# Altium schematic sheet Buck Converter.SchDoc
size A4; SheetNumber: 8; SheetTotal: 10
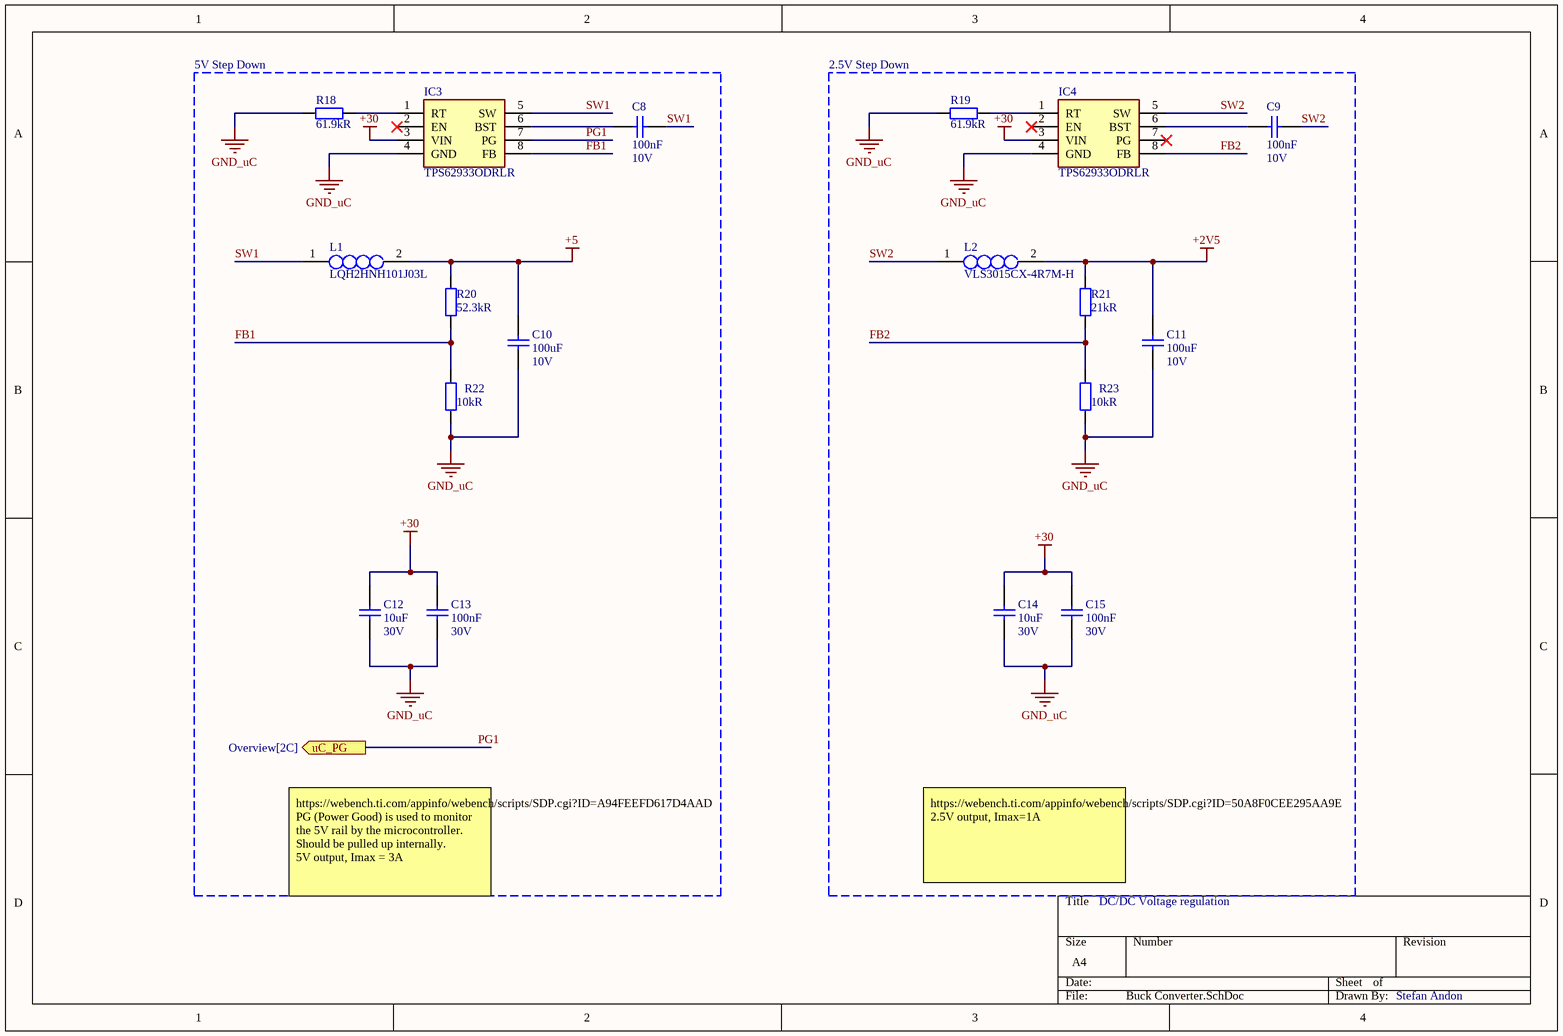
[diagram p0: Buck Converter.SchDoc]

## Parts
C8  value 100nF  Voltage: 10V  [CAP_0603]  (hidden comment: Capacitor_SMD)
C9  value 100nF  Voltage: 10V  [CAP_0603]  (hidden comment: Capacitor_SMD)
C10  value 100uF  Voltage: 10V  [CAP_0603]  (hidden comment: Capacitor_SMD)
C11  value 100uF  Voltage: 10V  [CAP_0603]  (hidden comment: Capacitor_SMD)
C12  value 10uF  Voltage: 30V  [CAP_0603]  (hidden comment: Capacitor_SMD)
C13  value 100nF  Voltage: 30V  [CAP_0603]  (hidden comment: Capacitor_SMD)
C14  value 10uF  Voltage: 30V  [CAP_0603]  (hidden comment: Capacitor_SMD)
C15  value 100nF  Voltage: 30V  [CAP_0603]  (hidden comment: Capacitor_SMD)
IC3  TPS62933ODRLR  [SOTFL50P160X60-8N]
IC4  TPS62933ODRLR  [SOTFL50P160X60-8N]
L1  LQH2HNH101J03L  [LQH2HNH100J03L]
L2  VLS3015CX-4R7M-H  [VLS3015]
R18  value 61.9kR  [RES_0603]  (hidden comment: Resistor_SMD)
R19  value 61.9kR  [RES_0603]  (hidden comment: Resistor_SMD)
R20  value 52.3kR  [RES_0603]  (hidden comment: Resistor_SMD)
R21  value 21kR  [RES_0603]  (hidden comment: Resistor_SMD)
R22  value 10kR  [RES_0603]  (hidden comment: Resistor_SMD)
R23  value 10kR  [RES_0603]  (hidden comment: Resistor_SMD)

## Blocks framed on the sheet
5V Step Down: C8 C10 C12 C13 IC3 L1 R18 R20 R22
2.5V Step Down: C9 C11 C14 C15 IC4 L2 R19 R21 R23

## Ports
uC_PG (out, see Overview[2C])

## Nets
+2V5: C11.2 L2.2 R21.1
+5: C10.2 L1.2 R20.1
+30: C12.2 C13.2 C14.2 C15.2 IC3.3(VIN) IC4.3(VIN)
GND_uC: C10.1 C11.1 C12.1 C13.1 C14.1 C15.1 IC3.4(GND) IC4.4(GND) R18.1 R19.1 R22.2 R23.2
FB1: IC3.8(FB) R20.2 R22.1
FB2: IC4.8(FB) R21.2 R23.1
PG1: IC3.7(PG) ; port uC_PG
SW1: C8.1 IC3.5(SW) L1.1
SW2: C9.1 IC4.5(SW) L2.1
NetC8_2: C8.2 IC3.6(BST)
NetC9_2: C9.2 IC4.6(BST)
NetIC3_1: IC3.1(RT) R18.2
NetIC4_1: IC4.1(RT) R19.2

Not connected (* = marked no-connect by the designer): IC3 2(EN)*; IC4 2(EN)* 7(PG)*

## Notes on the sheet
- https://webench.ti.com/appinfo/webench/scripts/SDP.cgi?ID=A94FEEFD617D4AAD
  PG (Power Good) is used to monitor the 5V rail by the microcontroller. Should be pulled up internally.
  5V output, Imax = 3A
- https://webench.ti.com/appinfo/webench/scripts/SDP.cgi?ID=50A8F0CEE295AA9E
  2.5V output, Imax=1A
- DC/DC Voltage regulation
- Stefan Andon

## Library data of the parts
C8 C9 = CMP-001-0004-13: SMD Capacitor; Tolerance: tbd; BOM: 100nF, 10V, tbd, tbd,CAP_0603; Dielectric: tbd; Package: tbd
C10 C11 = CMP-001-0004-13: SMD Capacitor; Tolerance: tbd; BOM: 100uF, 10V, tbd, tbd,CAP_0603; Dielectric: tbd; Package: tbd
C12 C14 = CMP-001-0004-13: SMD Capacitor; Tolerance: tbd; BOM: 10uF, 30V, tbd, tbd,CAP_0603; Dielectric: tbd; Package: tbd
C13 C15 = CMP-001-0004-13: SMD Capacitor; Tolerance: tbd; BOM: 100nF, 30V, tbd, tbd,CAP_0603; Dielectric: tbd; Package: tbd
IC3 IC4 = TPS62933ODRLR: Integrated Circuit; Manufacturer_Name: Texas Instruments; Datasheet Link: https://www.ti.com/lit/ds/symlink/tps62933o.pdf?ts=1692352588671&ref_url=https%253A%252F%252Fwww.ti.com%252Fproduct%252FTPS62933O%252Fpart-details%252FTPS62933ODRLR; Height: 0.6mm; Manufacturer_Part_Number: TPS62933ODRLR; Mouser Part Number: 595-TPS62933ODRLR; Mouser Price/Stock: https://www.mouser.co.uk/ProductDetail/Texas-Instruments/TPS62933ODRLR?qs=By6Nw2ByBD3VuSv7z7GudQ%3D%3D; Arrow Part Number: TPS62933ODRLR; Arrow Price/Stock: https://www.arrow.com/en/products/tps62933odrlr/texas-instruments?utm_currency=USD&region=nac
L1 = LQH2HNH101J03L: Inductor; Manufacturer_Name: Murata Electronics; Datasheet Link: https://search.murata.co.jp/Ceramy/image/img/P02/JELF243A-9157.pdf; Height: 1mm; Manufacturer_Part_Number: LQH2HNH101J03L; Mouser Part Number: 81-LQH2HNH101J03L; Mouser Price/Stock: https://www.mouser.co.uk/ProductDetail/Murata-Electronics/LQH2HNH101J03L?qs=t7xnP681wgVMHYq5XfcGGA%3D%3D
L2 = VLS3015CX-4R7M-H: Inductor; Manufacturer_Name: TDK; Datasheet Link: https://product.tdk.com/system/files/dam/doc/product/inductor/inductor/smd/catalog/inductor_automotive_power_vls3015cx-h_en.pdf; Manufacturer_Part_Number: VLS3015CX-4R7M-H; Mouser Part Number: 810-VLS3015CX-4R7M-H; Mouser Price/Stock: https://www.mouser.co.uk/ProductDetail/TDK/VLS3015CX-4R7M-H?qs=sPbYRqrBIVlQG%2FoSdSjKkg%3D%3D; Arrow Part Number: VLS3015CX-4R7M-H; Arrow Price/Stock: https://www.arrow.com/en/products/vls3015cx-4r7m-h/tdk?utm_currency=USD&region=nac
R18-R23 = CMP-001-0003-18: Tolerance: tbd; Power: 7W; BOM: Value+', '+Power+', '+Tolerance+', '+CurrentFootprint; Package: tbd